# Altium schematic sheet Frame Buffer.SchDoc
size A4
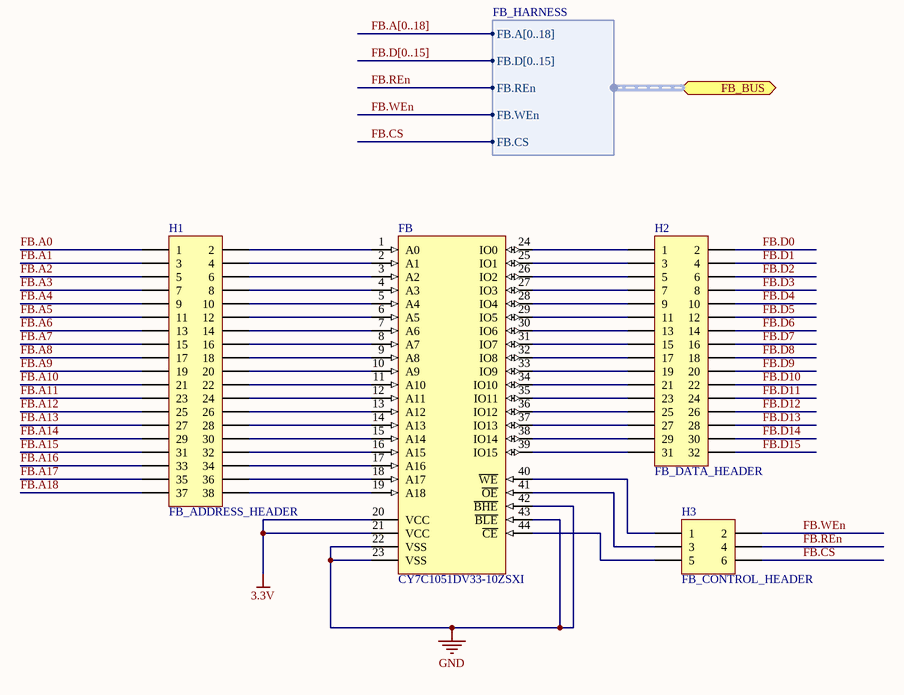
[diagram p0: Frame Buffer.SchDoc]

## Parts
FB  CY7C1051DV33-10ZSXI  [TSOP-44-SRAM]
H1  FB_ADDRESS_HEADER  [HDR2X19]
H2  FB_DATA_HEADER  [HDR2X16]
H3  FB_CONTROL_HEADER  [HDR2X3]

## Ports
FB_BUS (harness FB_HARNESS)

## Harnesses
FB_HARNESS: FB.A[0..18], FB.D[0..15], FB.REn, FB.WEn, FB.CS

## Nets
3.3V: FB.20(VCC) FB.21(VCC)
GND: FB.22(VSS) FB.23(VSS) FB.42(~{BHE}) FB.43(~{BLE})
FB.A0: H1.1
FB.A1: H1.3
FB.A2: H1.5
FB.A3: H1.7
FB.A4: H1.9
FB.A5: H1.11
FB.A6: H1.13
FB.A7: H1.15
FB.A8: H1.17
FB.A9: H1.19
FB.A10: H1.21
FB.A11: H1.23
FB.A12: H1.25
FB.A13: H1.27
FB.A14: H1.29
FB.A15: H1.31
FB.A16: H1.33
FB.A17: H1.35
FB.A18: H1.37
FB.CS: H3.6 ; port FB_BUS.FB.CS
FB.D0: H2.2
FB.D1: H2.4
FB.D2: H2.6
FB.D3: H2.8
FB.D4: H2.10
FB.D5: H2.12
FB.D6: H2.14
FB.D7: H2.16
FB.D8: H2.18
FB.D9: H2.20
FB.D10: H2.22
FB.D11: H2.24
FB.D12: H2.26
FB.D13: H2.28
FB.D14: H2.30
FB.D15: H2.32
FB.REn: H3.4 ; port FB_BUS.FB.REn
FB.WEn: H3.2 ; port FB_BUS.FB.WEn
NetFB_1: FB.1(A0) H1.2
NetFB_2: FB.2(A1) H1.4
NetFB_3: FB.3(A2) H1.6
NetFB_4: FB.4(A3) H1.8
NetFB_5: FB.5(A4) H1.10
NetFB_6: FB.6(A5) H1.12
NetFB_7: FB.7(A6) H1.14
NetFB_8: FB.8(A7) H1.16
NetFB_9: FB.9(A8) H1.18
NetFB_10: FB.10(A9) H1.20
NetFB_11: FB.11(A10) H1.22
NetFB_12: FB.12(A11) H1.24
NetFB_13: FB.13(A12) H1.26
NetFB_14: FB.14(A13) H1.28
NetFB_15: FB.15(A14) H1.30
NetFB_16: FB.16(A15) H1.32
NetFB_17: FB.17(A16) H1.34
NetFB_18: FB.18(A17) H1.36
NetFB_19: FB.19(A18) H1.38
NetFB_24: FB.24(IO0) H2.1
NetFB_25: FB.25(IO1) H2.3
NetFB_26: FB.26(IO2) H2.5
NetFB_27: FB.27(IO3) H2.7
NetFB_28: FB.28(IO4) H2.9
NetFB_29: FB.29(IO5) H2.11
NetFB_30: FB.30(IO6) H2.13
NetFB_31: FB.31(IO7) H2.15
NetFB_32: FB.32(IO8) H2.17
NetFB_33: FB.33(IO9) H2.19
NetFB_34: FB.34(IO10) H2.21
NetFB_35: FB.35(IO11) H2.23
NetFB_36: FB.36(IO12) H2.25
NetFB_37: FB.37(IO13) H2.27
NetFB_38: FB.38(IO14) H2.29
NetFB_39: FB.39(IO15) H2.31
NetFB_40: FB.40(~{WE}) H3.1
NetFB_41: FB.41(~{OE}) H3.3
NetFB_44: FB.44(~{CE}) H3.5

## Buses and harness runs
bus FB.A[0..18]
bus FB.D[0..15]

## Library data of the parts
FB = CY7C1051DV33-10ZSXI: pin to pad: 6>18 7>19 8>20 9>21 10>22 11>23 12>24 13>25 14>26 15>27 16>42 17>43 18>44 19>28 20>11 21>33 22>12 23>34 24>7 25>8 26>9 27>10 28>13 29>14 30>15 31>16 32>29 33>30 34>31 35>32 36>35 37>36 38>37 39>38 40>17 42>40 43>39 44>6
H1 = Header 19X2: Header, 19-Pin, Dual row; LatestRevisionDate: 17-Jul-2002; LatestRevisionNote: Re-released for DXP Platform.; Publisher: Altium Limited
H2 = Header 16X2: Header, 16-Pin, Dual row; LatestRevisionDate: 17-Jul-2002; LatestRevisionNote: Re-released for DXP Platform.; Publisher: Altium Limited
H3 = Header 3X2: Header, 3-Pin, Dual row; LatestRevisionDate: 17-Jul-2002; LatestRevisionNote: Re-released for DXP Platform.; Publisher: Altium Limited